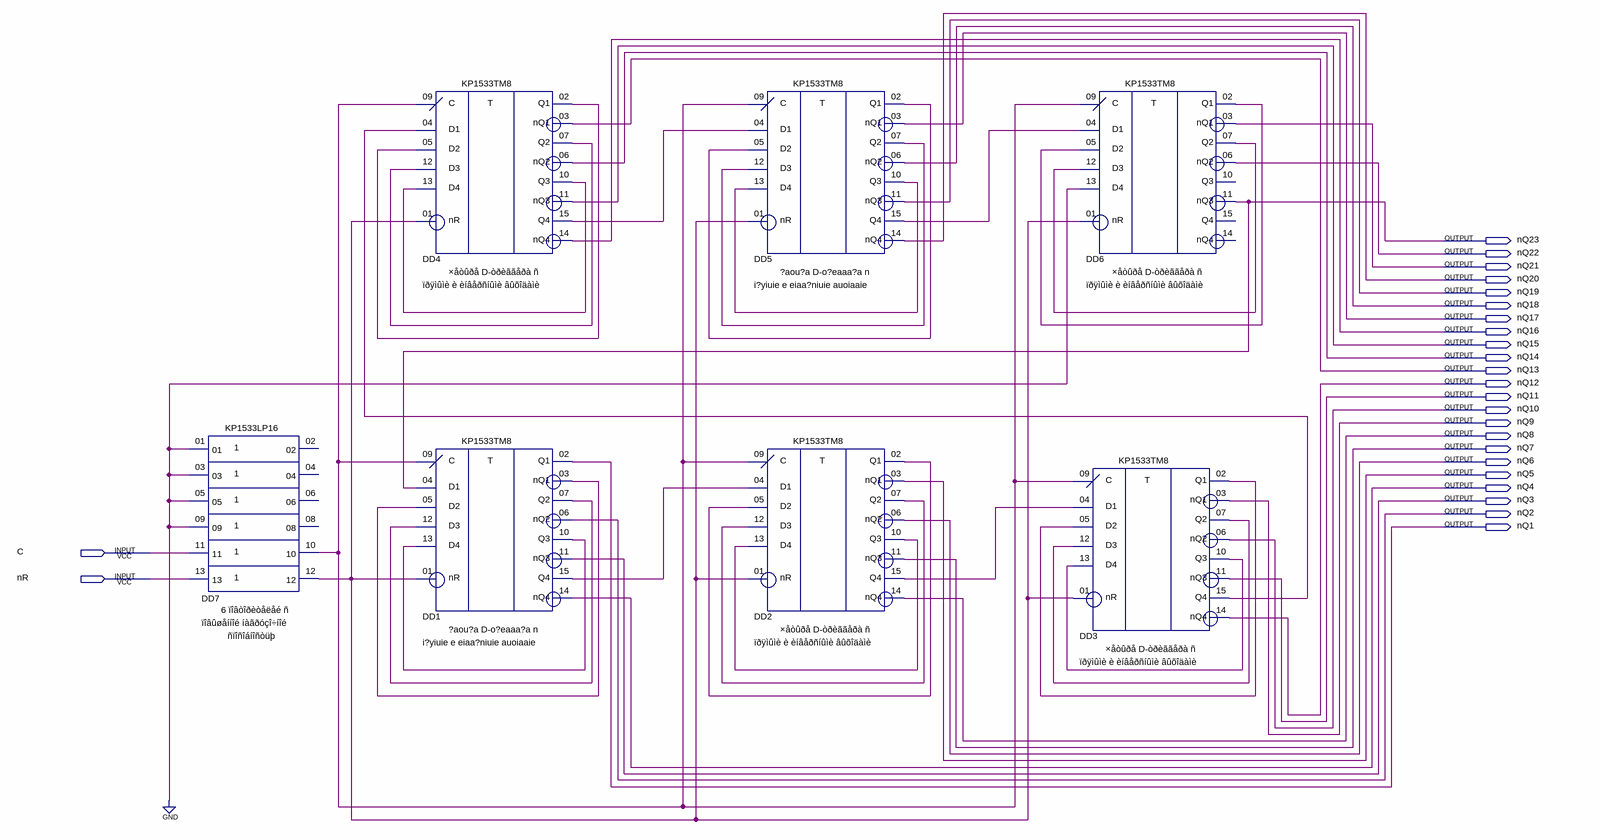
[diagram p0: schematic sheet]
// Quartus schematic _RingCounterDFF.bdf as structural Verilog: 7 symbols, 25 pins
module _RingCounterDFF (
  input  C,
  input  nR,
  output nQ23,
  output nQ22,
  output nQ21,
  output nQ20,
  output nQ19,
  output nQ18,
  output nQ17,
  output nQ16,
  output nQ15,
  output nQ14,
  output nQ13,
  output nQ12,
  output nQ11,
  output nQ10,
  output nQ9,
  output nQ8,
  output nQ7,
  output nQ6,
  output nQ5,
  output nQ4,
  output nQ3,
  output nQ2,
  output nQ1
);

  wire DD1_nq1, DD1_q2, DD1_q3, DD1_q4, DD2_q1, DD2_q2, DD2_q3, DD2_q4, DD3_q1, DD3_q2, DD3_q3, DD3_q4,
       DD4_q1, DD4_q2, DD4_q3, DD4_q4, DD5_q1, DD5_q2, DD5_q3, DD5_q4, DD6_q1, DD6_q2, DD7_10, DD7_12;

  KP1533LP16 DD7 (
    .\01 (1'b0), .\03 (1'b0), .\05 (1'b0), .\09 (1'b0), .\11 (C), .\13 (nR), .\10 (DD7_10), .\12 (DD7_12));  // open: 02, 04, 06, 08
  KP1533TM8 DD4 (
    .nR(DD7_12), .C(DD7_10), .D1(DD3_q4), .D2(DD4_q1), .D3(DD4_q2), .D4(DD4_q3), .Q1(DD4_q1), .nQ1(nQ13),
    .Q2(DD4_q2), .nQ2(nQ14), .Q3(DD4_q3), .nQ3(nQ15), .Q4(DD4_q4), .nQ4(nQ16));
  KP1533TM8 DD1 (
    .nR(DD7_12), .C(DD7_10), .D1(nQ23), .D2(DD1_nq1), .D3(DD1_q2), .D4(DD1_q3), .Q1(nQ1), .nQ1(DD1_nq1),
    .Q2(DD1_q2), .nQ2(nQ2), .Q3(DD1_q3), .nQ3(nQ3), .Q4(DD1_q4), .nQ4(nQ4));
  KP1533TM8 DD5 (
    .nR(DD7_12), .C(DD7_10), .D1(DD4_q4), .D2(DD5_q1), .D3(DD5_q2), .D4(DD5_q3), .Q1(DD5_q1), .nQ1(nQ17),
    .Q2(DD5_q2), .nQ2(nQ18), .Q3(DD5_q3), .nQ3(nQ19), .Q4(DD5_q4), .nQ4(nQ20));
  KP1533TM8 DD2 (
    .nR(DD7_12), .C(DD7_10), .D1(DD1_q4), .D2(DD2_q1), .D3(DD2_q2), .D4(DD2_q3), .Q1(DD2_q1), .nQ1(nQ5),
    .Q2(DD2_q2), .nQ2(nQ6), .Q3(DD2_q3), .nQ3(nQ7), .Q4(DD2_q4), .nQ4(nQ8));
  KP1533TM8 DD3 (
    .nR(DD7_12), .C(DD7_10), .D1(DD2_q4), .D2(DD3_q1), .D3(DD3_q2), .D4(DD3_q3), .Q1(DD3_q1), .nQ1(nQ9),
    .Q2(DD3_q2), .nQ2(nQ10), .Q3(DD3_q3), .nQ3(nQ11), .Q4(DD3_q4), .nQ4(nQ12));
  KP1533TM8 DD6 (
    .nR(DD7_12), .C(DD7_10), .D1(DD5_q4), .D2(DD6_q1), .D3(DD6_q2), .D4(1'b0), .Q1(DD6_q1), .nQ1(nQ21),
    .Q2(DD6_q2), .nQ2(nQ22), .nQ3(nQ23));  // open: Q3, Q4, nQ4
endmodule
